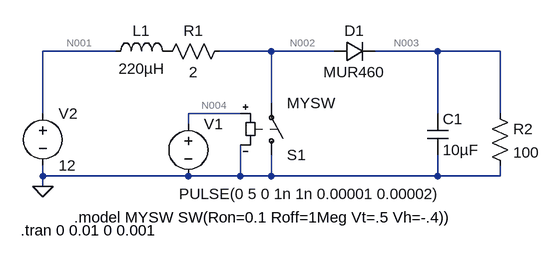
[diagram p0: schematic sim2.asc]
sim2.asc, the LTspice schematic file:
Version 4
SHEET 1 880 680
WIRE -64 64 -176 64
WIRE 176 64 96 64
WIRE 272 64 176 64
WIRE 432 64 336 64
WIRE 528 64 432 64
WIRE 176 144 176 64
WIRE -176 160 -176 64
WIRE 128 160 48 160
WIRE 432 160 432 64
WIRE 528 160 528 64
WIRE 48 176 48 160
WIRE -176 256 -176 240
WIRE 48 256 -176 256
WIRE 128 256 128 208
WIRE 128 256 48 256
WIRE 176 256 176 224
WIRE 176 256 128 256
WIRE 432 256 432 224
WIRE 432 256 176 256
WIRE 528 256 528 240
WIRE 528 256 432 256
WIRE -176 272 -176 256
FLAG -176 272 0
SYMBOL voltage 48 160 R0
WINDOW 3 -14 124 Left 2
WINDOW 123 0 0 Left 2
WINDOW 39 24 124 Left 2
SYMATTR Value PULSE(0 5 0 1n 1n 0.00001 0.00002)
SYMATTR InstName V1
SYMBOL voltage -176 144 R0
WINDOW 123 0 0 Left 2
WINDOW 39 0 0 Left 2
SYMATTR InstName V2
SYMATTR Value 12
SYMBOL sw 176 240 M180
SYMATTR InstName S1
SYMATTR Value MYSW
SYMBOL res 0 80 R270
WINDOW 0 32 56 VTop 2
WINDOW 3 0 56 VBottom 2
SYMATTR InstName R1
SYMATTR Value 2
SYMBOL res 512 144 R0
SYMATTR InstName R2
SYMATTR Value 100
SYMBOL cap 416 160 R0
SYMATTR InstName C1
SYMATTR Value 10µF
SYMBOL ind -80 80 R270
WINDOW 0 32 56 VTop 2
WINDOW 3 5 56 VBottom 2
SYMATTR InstName L1
SYMATTR Value 220µH
SYMBOL diode 272 80 R270
WINDOW 0 32 32 VTop 2
WINDOW 3 0 32 VBottom 2
SYMATTR InstName D1
SYMATTR Value MUR460
TEXT -128 320 Left 2 !.model MYSW SW(Ron=0.1 Roff=1Meg Vt=.5 Vh=-.4))
TEXT -210 340 Left 2 !.tran 0 0.01 0 0.001

The netlist it stands for:
* sim2.asc
V1 N004 0 PULSE(0 5 0 1n 1n 0.00001 0.00002)
V2 N001 0 12
S1 0 N002 N004 0 MYSW
R1 P001 N002 2
R2 N003 0 100
C1 N003 0 10µF
L1 N001 P001 220µH
D1 N002 N003 MUR460
.model D D
.lib standard.dio
.model MYSW SW(Ron=0.1 Roff=1Meg Vt=.5 Vh=-.4))
.tran 0 0.01 0 0.001
.backanno
.end

* Results of the author's LTspice run, read from the files saved beside the schematic
* Operating Point, zero values left out:
*   V(n001) = 12 V
*   V(n002) = 11.78 V
*   V(p001) = 12 V
*   V(n003) = 11.07 V
*   I(D1) = 110.7 mA
*   I(L1) = 110.8 mA
*   I(R2) = 110.7 mA
*   I(R1) = 110.8 mA
*   I(S1) = 11.78 µA
*   I(V2) = -110.8 mA
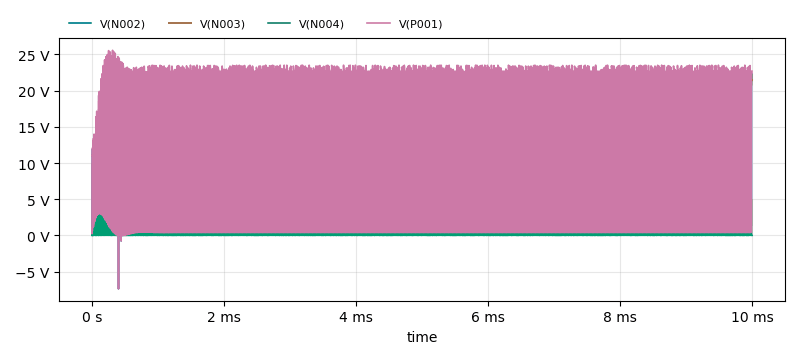
[diagram p1: Transient Analysis of sim2.asc, plotted from the saved traces]
* Transient Analysis, 1 run:
*   V(N002): min -7.723 V, max 24.16 V, average 11.09 V, rms 15.67 V, last 22.24 V
*   V(N003): min 10.96 V, max 23.41 V, average 21.33 V, rms 21.36 V, last 21.51 V
*   V(N004): min 0 V, max 5 V, average 2.5 V, rms 3.536 V, last 0 V
*   V(P001): min -7.722 V, max 25.71 V, average 11.99 V, rms 16.32 V, last 22.61 V